# Altium schematic sheet CAN.SchDoc
size A4
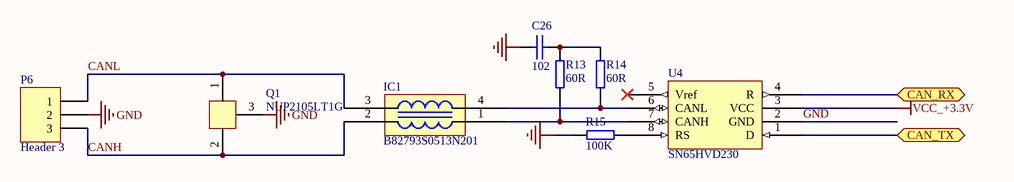
[diagram p0: CAN.SchDoc]

## Parts
C26  102  [0603C]
IC1  B82793S0513N201  [EPCOS_Chokes]
P6  Header 3  [XH254-3P]
Q1  NUP2105LT1G  [SOT23]
R13  60R  [0603R]
R14  60R  [0603R]
R15  100K  [0603R]
U4  SN65HVD230  [SOP8]

## Ports
CAN_RX (bidir), CAN_TX (bidir)

## Nets
GND: C26.1 P6.2 Q1.3 R15.2 U4.2(GND)
VCC_+3.3V: U4.3(VCC)
CAN_RX: U4.4(R) ; port CAN_RX
CAN_TX: U4.1(D) ; port CAN_TX
CANH: IC1.2 P6.3 Q1.2
CANL: IC1.3 P6.1 Q1.1
NetC26_2: C26.2 R13.2 R14.2
NetIC1_1: IC1.1 R13.1 U4.7(CANH)
NetIC1_4: IC1.4 R14.1 U4.6(CANL)
NetR15_1: R15.1 U4.8(RS)

Not connected (* = marked no-connect by the designer): U4 5(Vref)*

## Library data of the parts
C26 = CAP: Capacitor
IC1 = EPCOS Chokes: Common-mode chokes, ring core
P6 = Header 3: Header, 3-Pin; LatestRevisionDate: 17-Jul-2002; LatestRevisionNote: Re-released for DXP Platform.; Publisher: Altium Limited
Q1 = SOT23
R13-R15 = RES2A
U4 = SN65HVD230D